# Altium schematic sheet Control_Module_RS485.SchDoc: Módulo de Control - Conexión RS485
size A4; Author: Martin C.A. Yunis; CompanyName: Sistema de Control de Acceso; Revision: V1; SheetNumber: 4; SheetTotal: 7
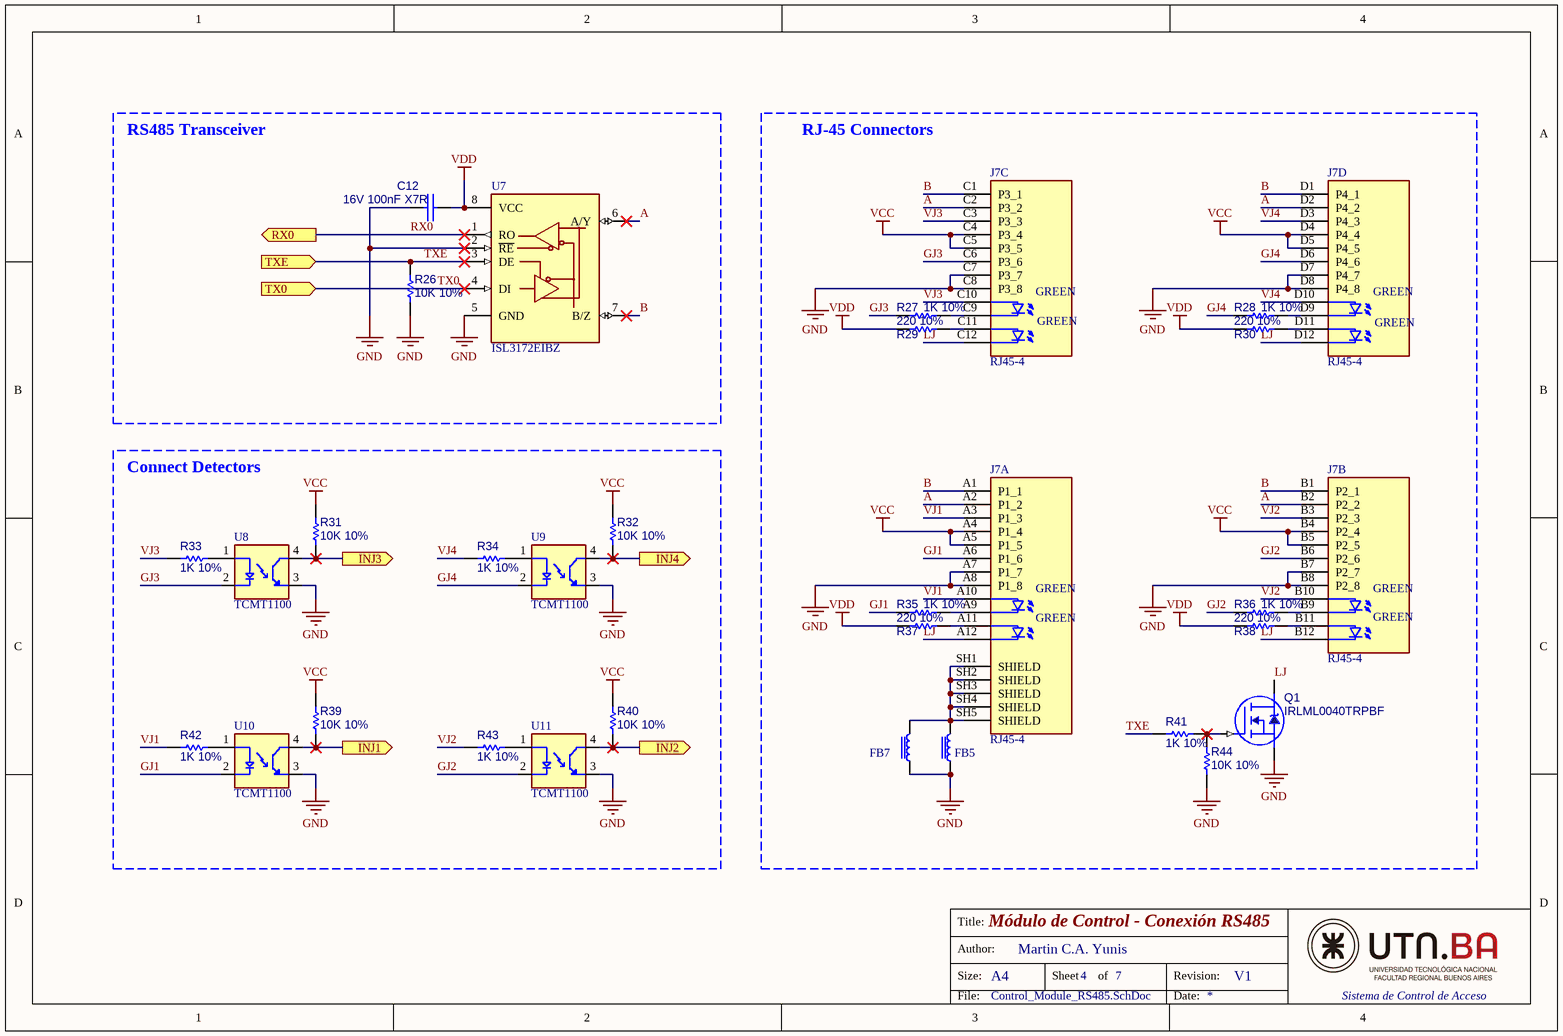
[diagram p0: Control_Module_RS485.SchDoc]

## Parts
C12  16V 100nF X7R  [CAP0402]
FB5  Choke 450mΩ ±25%  [CHOKE0603]  (value not drawn)
FB7  Choke 450mΩ ±25%  [CHOKE0603]  (value not drawn)
J7  RJ45-4  [615032137921]  (parts A,B,C,D of 4)
Q1  IRLML0040TRPBF  [SOT_23]
R26  10K 10%  [RES0402]
R27  1K 10%  [RES0402]
R28  1K 10%  [RES0402]
R29  220 10%  [RES0402]
R30  220 10%  [RES0402]
R31  10K 10%  [RES0402]
R32  10K 10%  [RES0402]
R33  1K 10%  [RES0402]
R34  1K 10%  [RES0402]
R35  1K 10%  [RES0402]
R36  1K 10%  [RES0402]
R37  220 10%  [RES0402]
R38  220 10%  [RES0402]
R39  10K 10%  [RES0402]
R40  10K 10%  [RES0402]
R41  1K 10%  [RES0402]
R42  1K 10%  [RES0402]
R43  1K 10%  [RES0402]
R44  10K 10%  [RES0402]
U7  ISL3172EIBZ  [SOIC127P600X175-8N]
U8  TCMT1100  [SOIC127P700X230-4N]
U9  TCMT1100  [SOIC127P700X230-4N]
U10  TCMT1100  [SOIC127P700X230-4N]
U11  TCMT1100  [SOIC127P700X230-4N]

## Blocks framed on the sheet
RS485 Transceiver: C12 R26 U7
RJ-45 Connectors: FB5 FB7 J7 Q1 R27-R30 R35-R38 R41 R44
Connect Detectors: R31-R34 R39 R40 R42 R43 U8-U11

## Ports
INJ1 (out, see Control_Module_MAIN[3C], Control_Module_CPU[2B]), INJ2 (out, see Control_Module_MAIN[3C], Control_Module_CPU[2B]), INJ3 (out, see Control_Module_MAIN[3C], Control_Module_CPU[2C]), INJ4 (out, see Control_Module_MAIN[3C], Control_Module_CPU[2C]), RX0 (out, see Control_Module_MAIN[3B], Control_Module_CPU[2B]), TX0 (in, see Control_Module_MAIN[3B], Control_Module_CPU[2B]), TXE (in, see Control_Module_MAIN[3B], Control_Module_CPU[1B])

## Nets
GND: C12.1 FB5.1 FB7.1 J7.A7(P1_7) J7.A8(P1_8) J7.B7(P2_7) J7.B8(P2_8) J7.C7(P3_7) J7.C8(P3_8) J7.D7(P4_7) J7.D8(P4_8) Q1.2(SOURCE) R26.2 R44.2 U7.2(~{RE}) U7.5(GND) U8.3(ET) U9.3(ET) U10.3(ET) U11.3(ET)
VCC: J7.A4(P1_4) J7.A5(P1_5) J7.B4(P2_4) J7.B5(P2_5) J7.C4(P3_4) J7.C5(P3_5) J7.D4(P4_4) J7.D5(P4_5) R31.1 R32.1 R39.1 R40.1
VDD: C12.2 R29.1 R30.1 R37.1 R38.1 U7.8(VCC)
A: J7.A2(P1_2) J7.B2(P2_2) J7.C2(P3_2) J7.D2(P4_2) U7.6(A/Y)
B: J7.A1(P1_1) J7.B1(P2_1) J7.C1(P3_1) J7.D1(P4_1) U7.7(B/Z)
GJ1: J7.A6(P1_6) R35.1 U10.2(C)
GJ2: J7.B6(P2_6) R36.1 U11.2(C)
GJ3: J7.C6(P3_6) R27.1 U8.2(C)
GJ4: J7.D6(P4_6) R28.1 U9.2(C)
INJ1: R39.2 U10.4(CT) ; port INJ1
INJ2: R40.2 U11.4(CT) ; port INJ2
INJ3: R31.2 U8.4(CT) ; port INJ3
INJ4: R32.2 U9.4(CT) ; port INJ4
LJ: J7.A12(P1_CATHODE_GRN2) J7.B12(P2_CATHODE_GRN2) J7.C12(P3_CATHODE_GRN2) J7.D12(P4_CATHODE_GRN2) Q1.3(DRAIN)
RX0: U7.1(RO) ; port RX0
TX0: U7.4(DI) ; port TX0
TXE: R26.1 R41.1 U7.3(DE) ; port TXE
VJ1: J7.A3(P1_3) J7.A10(P1_ANODE_GRN1) R42.1
VJ2: J7.B3(P2_3) J7.B10(P2_ANODE_GRN1) R43.1
VJ3: J7.C3(P3_3) J7.C10(P3_ANODE_GRN1) R33.1
VJ4: J7.D3(P4_3) J7.D10(P4_ANODE_GRN1) R34.1
NetFB5_2: FB5.2 FB7.2 J7.SH1(SHIELD) J7.SH2(SHIELD) J7.SH3(SHIELD) J7.SH4(SHIELD) J7.SH5(SHIELD)
NetJ7_A9: J7.A9(P1_CATHODE_GRN1) R35.2
NetJ7_A11: J7.A11(P1_ANODE_GRN2) R37.2
NetJ7_B9: J7.B9(P2_CATHODE_GRN1) R36.2
NetJ7_B11: J7.B11(P2_ANODE_GRN2) R38.2
NetJ7_C9: J7.C9(P3_CATHODE_GRN1) R27.2
NetJ7_C11: J7.C11(P3_ANODE_GRN2) R29.2
NetJ7_D9: J7.D9(P4_CATHODE_GRN1) R28.2
NetJ7_D11: J7.D11(P4_ANODE_GRN2) R30.2
NetQ1_1: Q1.1(GATE) R41.2 R44.1
NetR33_2: R33.2 U8.1(A)
NetR34_2: R34.2 U9.1(A)
NetR42_2: R42.2 U10.1(A)
NetR43_2: R43.2 U11.1(A)

## Notes on the sheet
- Title:
- Size:
- Author:
- A4
- Sheet
- of
- Revision:
- File:
- Date:
- (in symbol RJ45-4, part A) GREEN
- (in symbol RJ45-4, part B) GREEN
- (in symbol RJ45-4, part C) GREEN
- (in symbol RJ45-4, part D) GREEN

## Library data of the parts
C12 = CAP: Non Polarized Capacitor; MANUF P/N: CL05B104KO5NNNC; JLCPCB P/N: C1525
FB5 FB7 = Choke: High Frequency EMI Suppression Ferrite Bead; Manufacturer Part Number: 742863160; Manufacturer: Wurth Elektronik; Match Code: WE-CBF HF; Case/Size Code: 0603; DC Resistance: 0.22Ohm; Impedance @100MHz: 600Ohm; Impedance @1GHz: 800Ohm; Impedance Max: 950Ohm; Impedance Max Test Condition: 600MHz; Rated Current: 0.5A; Type: High Current; Category: Ferrites for PCB Assembly; ComponentLink1Description: Website Link; ComponentLink1URL: https://www.we-online.com/redexpert/article/742863160?ad; ComponentLink2Description: Datasheet Link; ComponentLink2URL: https://www.we-online.com/redexpert/spec/742863160?ad; Mount: Surface Mount; Operating Temperature Max: 125°C; Operating Temperature Min: -55°C; Packaging: Tape and Reel; Length: 1.6mm; Width: 0.8mm; Height: 0.8mm
J7 = RJ45-4: Quadruple RJ-45 Connector; MANUF P/N: HC-RJ45-5JA-4-2; MP: 1888251-4; Package: None; Price: None; Value: *; Availability: Unavailable; JLCPCB P/N: C3000183
Q1 = N_MOSFET_SOT23: Mosfet N-Ch; MANUF P/N: IRLML0040TRPBF; JLCPCB P/N: C67273
R26 R31 R32 R39 R40 R44 = Res1: Resistor; MANUF P/N: CRCW040210K0FKED; JLCPCB P/N: C71617
R27 R28 R33-R36 R41-R43 = Res1: Resistor; MANUF P/N: CRCW04021K00FKED; JLCPCB P/N: C71623
R29 R30 R37 R38 = Res1: Resistor; MANUF P/N: CR0402FF2200G; JLCPCB P/N: C100308
U7 = ISL3172EIBZ: 1/1 Transceiver Half RS422, RS485 8-SOIC; MF: Renesas Electronics America Inc; SnapEDA_Link: https://www.snapeda.com/parts/ISL3172EIBZ/Renesas/view-part/?ref=snap; Package: SOIC-8 Renesas; Value: *; MP: ISL3172EIBZ; Check_prices: https://www.snapeda.com/parts/ISL3172EIBZ/Renesas/view-part/?ref=eda; MANUF P/N: ISL3172EIBZ; JLCPCB P/N: C5772578
U8-U11 = TCMT1100: Optoisolator Transistor Output 3750Vrms 1 Channel 4-SOP; MF: Vishay Semiconductor; SnapEDA_Link: https://www.snapeda.com/parts/TCMT1100/Vishay/view-part/?ref=snap; Package: SOP-4 Vishay Semiconductor; Value: *; MP: TCMT1100; Check_prices: https://www.snapeda.com/parts/TCMT1100/Vishay/view-part/?ref=eda; MANUF P/N: TCMT1100; JLCPCB P/N: C118298